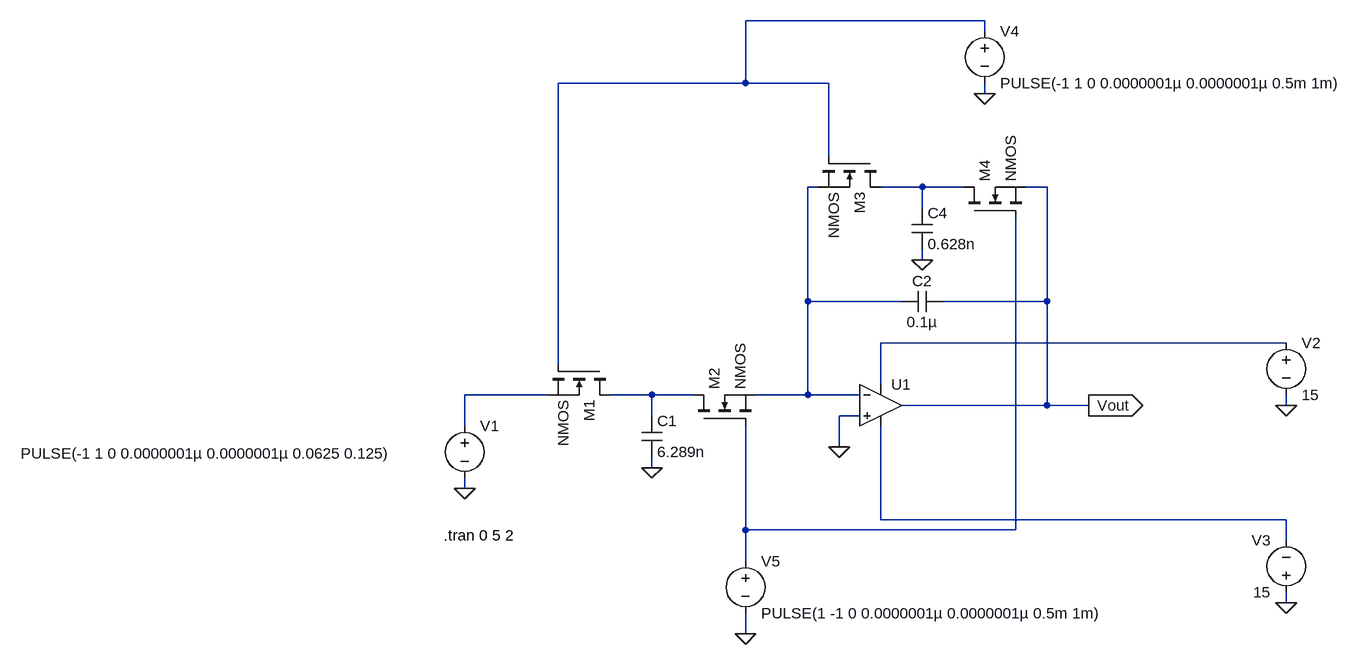
[diagram p0: schematic switched_capacitor_integrator.asc]
switched_capacitor_integrator.asc, the LTspice schematic file:
Version 4
SHEET 1 1104 804
WIRE 512 -432 144 -432
WIRE 512 -416 512 -432
WIRE 144 -336 144 -432
WIRE 144 -336 -144 -336
WIRE 272 -336 144 -336
WIRE 512 -320 512 -336
WIRE 272 -224 272 -336
WIRE 256 -176 240 -176
WIRE 416 -176 352 -176
WIRE 480 -176 416 -176
WIRE 608 -176 576 -176
WIRE 416 -144 416 -176
WIRE 416 -64 416 -80
WIRE 240 0 240 -176
WIRE 384 0 240 0
WIRE 608 0 608 -176
WIRE 608 0 448 0
WIRE 976 64 352 64
WIRE -144 96 -144 -336
WIRE 352 128 352 64
WIRE -160 144 -288 144
WIRE 0 144 -64 144
WIRE 64 144 0 144
WIRE 240 144 240 0
WIRE 240 144 160 144
WIRE 320 144 240 144
WIRE 608 160 608 0
WIRE 608 160 384 160
WIRE 672 160 608 160
WIRE 976 160 976 144
WIRE 0 176 0 144
WIRE 320 176 288 176
WIRE -288 192 -288 144
WIRE 288 224 288 176
WIRE 0 256 0 240
WIRE -288 288 -288 272
WIRE 352 336 352 192
WIRE 976 336 352 336
WIRE 144 352 144 192
WIRE 560 352 560 -128
WIRE 560 352 144 352
WIRE 976 368 976 336
WIRE 144 400 144 352
WIRE 976 464 976 448
WIRE 144 512 144 480
FLAG 0 256 0
FLAG 416 -64 0
FLAG 288 224 0
FLAG -288 288 0
FLAG 672 160 Vout
IOPIN 672 160 Out
FLAG 976 464 0
FLAG 976 160 0
FLAG 512 -320 0
FLAG 144 512 0
SYMBOL OpAmps\\UniversalOpamp2 352 160 R0
SYMATTR InstName U1
SYMBOL cap -16 176 R0
SYMATTR InstName C1
SYMATTR Value 6.289n
SYMBOL cap 448 -16 R90
WINDOW 0 0 32 VBottom 2
WINDOW 3 32 32 VTop 2
SYMATTR InstName C2
SYMATTR Value 0.1µ
SYMBOL nmos -64 96 R90
SYMATTR InstName M1
SYMBOL nmos 64 192 R270
SYMATTR InstName M2
SYMBOL cap 400 -144 R0
SYMATTR InstName C4
SYMATTR Value 0.628n
SYMBOL nmos 352 -224 R90
SYMATTR InstName M3
SYMBOL nmos 480 -128 R270
SYMATTR InstName M4
SYMBOL voltage -288 176 R0
WINDOW 123 0 0 Left 0
WINDOW 39 0 0 Left 0
WINDOW 3 -683 58 Left 2
SYMATTR InstName V1
SYMATTR Value PULSE(-1 1 0 0.0000001µ 0.0000001µ 0.0625 0.125)
SYMBOL voltage 976 48 R0
WINDOW 123 0 0 Left 0
WINDOW 39 0 0 Left 0
SYMATTR InstName V2
SYMATTR Value 15
SYMBOL voltage 976 464 R180
WINDOW 0 24 96 Left 2
WINDOW 3 24 16 Left 2
WINDOW 123 0 0 Left 0
WINDOW 39 0 0 Left 0
SYMATTR InstName V3
SYMATTR Value 15
SYMBOL voltage 512 -432 R0
WINDOW 123 0 0 Left 0
WINDOW 39 0 0 Left 0
SYMATTR InstName V4
SYMATTR Value PULSE(-1 1 0 0.0000001µ 0.0000001µ 0.5m 1m)
SYMBOL voltage 144 384 R0
WINDOW 123 0 0 Left 0
WINDOW 39 0 0 Left 0
SYMATTR InstName V5
SYMATTR Value PULSE(1 -1 0 0.0000001µ 0.0000001µ 0.5m 1m)
TEXT -320 360 Left 2 !.tran 0 5 2

The netlist it stands for:
* switched_capacitor_integrator.asc
XU1 0 N002 N004 N007 Vout level.2 Avol=1Meg GBW=10Meg Slew=10Meg ilimit=25m rail=0 Vos=0 phimargin=45 en=0 enk=0 in=0 ink=0 Rin=500Meg  ; pins IN+ IN- V+ V- OUT
C1 N006 0 6.289n
C2 Vout N002 0.1µ
M1 N006 N001 N005 N005 NMOS
M2 N006 N008 N002 N002 NMOS
C4 N003 0 0.628n
M3 N003 N001 N002 N002 NMOS
M4 N003 N008 Vout Vout NMOS
V1 N005 0 PULSE(-1 1 0 0.0000001µ 0.0000001µ 0.0625 0.125)
V2 N004 0 15
V3 0 N007 15
V4 N001 0 PULSE(-1 1 0 0.0000001µ 0.0000001µ 0.5m 1m)
V5 N008 0 PULSE(1 -1 0 0.0000001µ 0.0000001µ 0.5m 1m)
.model NMOS NMOS
.model PMOS PMOS
.lib standard.mos
.tran 0 5 2
.lib UniversalOpamps2.sub
.backanno
.end